# EAGLE design igvc-neopixel (EAGLE 9.5.2)
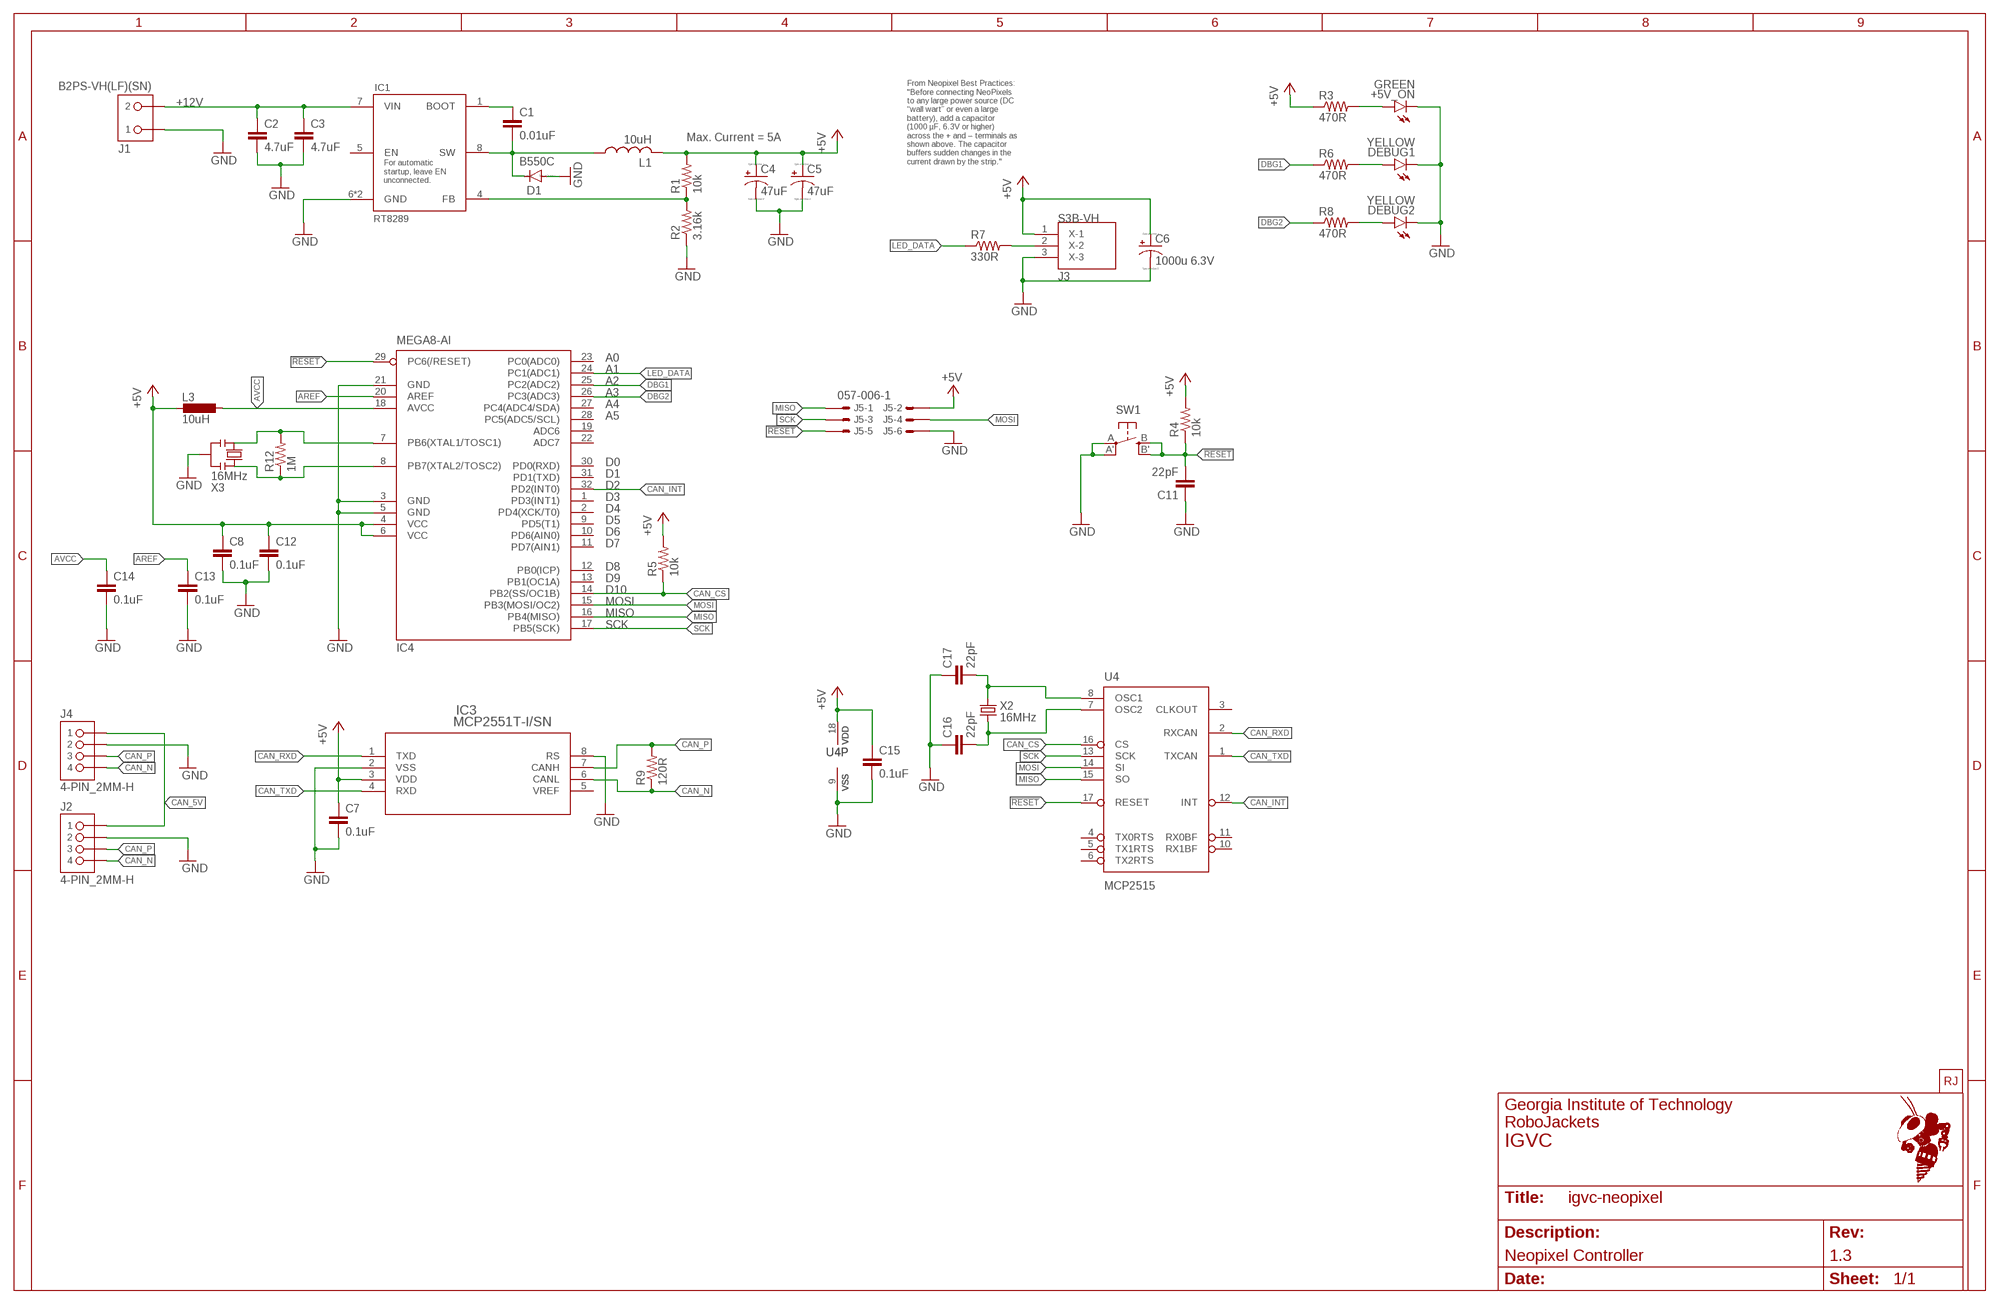
[diagram p0: schematic, sheet 1]
FRAME2 (FRAME_B_L): REVISION: 1.3; SCH_DESC: Neopixel Controller; TEAM: IGVC

## Parts
+5V_ON  GREEN  LEDCHIP-LED0805  [CHIP-LED0805]
C1  0.01uF  C-EUC0603  [C0603]
C2  4.7uF  C-EUC1206  [C1206]
C3  4.7uF  C-EUC1206  [C1206]
C4  47uF  CPOL-USE5-10.5  [E5-10,5]
C5  47uF  CPOL-USE5-10.5  [E5-10,5]
C6  1000u 6.3V  CPOL-USE5-10.5  [E5-10,5]
C7  0.1uF  C-EUC0603  [C0603]
C8  0.1uF  C-EUC0603  [C0603]
C11  22pF  C-EUC0603  [C0603]
C12  0.1uF  C-EUC0603  [C0603]
C13  0.1uF  C-EUC0603  [C0603]
C14  0.1uF  C-EUC0603  [C0603]
C15  0.1uF  C-EUC0603  [C0603]
C16  22pF  C-EUC0603  [C0603]
C17  22pF  C-EUC0603  [C0603]
D1  B550C  DIODE-SMC  [SMC]
DEBUG1  YELLOW  LEDCHIP-LED0805  [CHIP-LED0805]
DEBUG2  YELLOW  LEDCHIP-LED0805  [CHIP-LED0805]
IC1  RT8289  [SOIC8_EP]
IC3  MCP2551T-I/SN  [SOIC8-N_MC]
IC4  MEGA8-AI  [TQFP32-08]
J1  B2PS-VH(LF)(SN)  [B2PS-CENTERED]
J2  4-PIN_2MM-H  [2MM-4-H]
J3  S3B-VH  [S3B-VH]
J4  4-PIN_2MM-H  [2MM-4-H]
J5  057-006-1  [057-006-1]
L1  10uH  SRR1208  [SRR1208]
L3  10uH  L-0805  [0805]
R1  10k  R-US_R0603  [R0603]
R2  3.16k  R-US_R0603  [R0603]
R3  470R  R-US_R0603  [R0603]
R4  10k  R-US_R0603  [R0603]
R5  10k  R-US_R0603  [R0603]
R6  470R  R-US_R0603  [R0603]
R7  330R  R-US_R0603  [R0603]
R8  470R  R-US_R0603  [R0603]
R9  120R  R-US_R0603  [R0603]
R12  1M  R-US_R0603  [R0603]
SW1  SPST_TACT-EVQQ2  [EVQ-Q2]
U4  MCP2515  MCP2510SO  [SO-18W]
U$1  ROBOBUZZ0.6X  [ROBOBUZZ_0.6X]
X2  16MHz  CRYSTAL5X3  [CRYSTAL-SMD-5X3]
X3  16MHz  OSC_CSTCE16M0V53-R0  [RESONATOR]

## Nets
!RESET: C11.2 IC4.29(PC6(/RESET)) J5.5 R4.1 SW1.B'(S1) SW1.B(S) U4.17(RESET)
+5V [power]: C4.+ C5.+ C6.+ C7.1 C8.1 C12.1 C15.1 IC3.3(VDD) IC4.4(VCC) IC4.6(VCC) J3.1(X-1) J5.2 L1.2 L3.2 R1.2 R3.1 R4.2 R5.2 U4.18(VDD)
+12V [power]: C2.1 C3.1 IC1.7(VIN) J1.2
AREF: C13.1 IC4.20(AREF)
AVCC: C14.1 IC4.18(AVCC) L3.1
BOOT: C1.1 IC1.1(BOOT)
CAN_5V [power]: J2.1 J4.1
CAN_CS: IC4.14(PB2(SS/OC1B)) R5.1 U4.16(CS)
CAN_INT: IC4.32(PD2(INT0)) U4.12(INT)
CAN_N: IC3.6(CANL) J2.4 J4.4 R9.1
CAN_P: IC3.7(CANH) J2.3 J4.3 R9.2
CAN_RXD: IC3.1(TXD) U4.2(RXCAN)
CAN_TXD: IC3.4(RXD) U4.1(TXCAN)
DBG1 [power]: IC4.25(PC2(ADC2)) R6.1
DBG2 [power]: IC4.26(PC3(ADC3)) R8.1
FB: IC1.4(FB) R1.1 R2.2
GND [power]: +5V_ON.C C2.2 C3.2 C4.- C5.- C6.- C7.2 C8.2 C11.1 C12.2 C13.2 C14.2 C15.2 C16.1 C17.1 D1.A DEBUG1.C DEBUG2.C IC1.6(GND) IC1.EXP(GND) IC3.2(VSS) IC3.8(RS) IC4.3(GND) IC4.5(GND) IC4.21(GND) J1.1 J2.2 J3.3(X-3) J4.2 J5.6 R2.1 SW1.A'(P1) SW1.A(P) U4.9(VSS) X3.2
LED_DATA: IC4.24(PC1(ADC1)) R7.1
MISO: IC4.16(PB4(MISO)) J5.1 U4.15(SO)
MOSI: IC4.15(PB3(MOSI/OC2)) J5.4 U4.14(SI)
N$17: C17.2 U4.8(OSC1) X2.3
N$18: C16.2 U4.7(OSC2) X2.1
NEOPIXEL: J3.2(X-2) R7.2
PWR_LED: +5V_ON.A R3.2
SCK: IC4.17(PB5(SCK)) J5.3 U4.13(SCK)
STAT1_LED: DEBUG1.A R6.2
STAT2_LED: DEBUG2.A R8.2
SW [power]: C1.2 D1.C IC1.8(SW) L1.1
XTAL1: IC4.7(PB6(XTAL1/TOSC1)) R12.2 X3.1
XTAL2: IC4.8(PB7(XTAL2/TOSC2)) R12.1 X3.3
Unconnected: IC1.5(EN) IC3.5(VREF) IC4.1(PD3(INT1)) IC4.2(PD4(XCK/T0)) IC4.9(PD5(T1)) IC4.10(PD6(AIN0)) IC4.11(PD7(AIN1)) IC4.12(PB0(ICP)) IC4.13(PB1(OC1A)) IC4.19(ADC6) IC4.22(ADC7) IC4.23(PC0(ADC0)) IC4.27(PC4(ADC4/SDA)) IC4.28(PC5(ADC5/SCL)) IC4.30(PD0(RXD)) IC4.31(PD1(TXD)) U4.3(CLKOUT) U4.4(TX0RTS) U4.5(TX1RTS) U4.6(TX2RTS) U4.10(RX1BF) U4.11(RX0BF)

## Notes on the sheet
- Max. Current = 5A
- From Neopixel Best Practices:
  "Before connecting NeoPixels
  to any large power source (DC
  “wall wart” or even a large
  battery), add a capacitor
  (1000 µF, 6.3V or higher)
  across the + and – terminals as
  shown above. The capacitor
  buffers sudden changes in the
  current drawn by the strip."
- For automatic
  startup, leave EN
  unconnected.
- A0
- A1
- A2
- A3
- A4
- A5
- D0
- D1
- D2
- D3
- D4
- D5
- D6
- D7
- D8
- D9
- D10

## Library data of the parts
+5V_ON = led:LED: LED OSRAM: - CHIPLED LG R971, LG N971, LY N971, LG Q971, LY Q971, LO R971, LY R971 LH N974, LH R974 LS Q976, LO Q976, LY Q976 LO Q996 - Hyper CHIPLED LW Q18S LB Q993, LB Q99A, LB R99A - SideLED LS A670, LO A670, LY A670, LG A670, LP A670 LB A673, LV A673, LT A673, LW A673 LH A674 LY A675 LS A676, LA A676, LO A676, LY A676, LW A676 LS A679, LY A679, LG A679 - Hyper Micro SIDELED® LS Y876, LA Y876, LO Y876, LY Y876 LT Y87S - SmartLED LW L88C, LW L88S LB L89C, LB L89S, LG L890 LS L89K, LO L89K, LY L89K LS L896, LA L896, LO L896, LY L896 - TOPLED LS T670, LO T670, LY T670, LG T670, LP T670 LSG T670, LSP T670, LSY T670, LOP T670, LYG T670 LG T671, LOG T671, LSG T671 LB T673, LV T673, LT T673, LW T673 LH T674 LS T676, LA T676, LO T676, LY T676, LB T676, LH T676, LSB T676, LW T676 LB T67C, LV T67C, LT T67C, LS T67K, LO T67K, LY T67K, LW E67C LS E67B, LA E67B, LO E67B, LY E67B, LB E67C, LV E67C, LT E67C LW T67C LS T679, LY T679, LG T679 LS T770, LO T770, LY T770, LG T770, LP T770 LB T773, LV T773, LT T773, LW T773 LH T774 LS E675, LA E675, LY E675, LS T675 LS T776, LA T776, LO T776, LY T776, LB T776 LHGB T686 LT T68C, LB T68C - Hyper Mini TOPLED® LB M676 - Mini TOPLED Santana® LG M470 LS M47K, LO M47K, LY M47K Source: http://www.osram.convergy.de LUXEON: - LUMILED® LXK2-PW12-R00, LXK2-PW12-S00, LXK2-PW14-U00, LXK2-PW14-V00 LXK2-PM12-R00, LXK2-PM12-S00, LXK2-PM14-U00 LXK2-PE12-Q00, LXK2-PE12-R00, LXK2-PE12-S00, LXK2-PE14-T00, LXK2-PE14-U00 LXK2-PB12-K00, LXK2-PB12-L00, LXK2-PB12-M00, LXK2-PB14-N00, LXK2-PB14-P00, LXK2-PB14-Q00 LXK2-PR12-L00, LXK2-PR12-M00, LXK2-PR14-Q00, LXK2-PR14-R00 LXK2-PD12-Q00, LXK2-PD12-R00, LXK2-PD12-S00 LXK2-PH12-R00, LXK2-PH12-S00 LXK2-PL12-P00, LXK2-PL12-Q00, LXK2-PL12-R00 Source: www.luxeon.com KINGBRIGHT: KA-3528ASYC Source: www.kingbright.com; DIGIKEY: 732-4982-1-ND
C1 = resistor:C-EU: CAPACITOR, European symbol; DIGIKEY: 311-1572-1-ND
C2 C3 = resistor:C-EU: CAPACITOR, European symbol; DIGIKEY: 1276-3178-1-ND
C4 C5 = resistor:CPOL-US: POLARIZED CAPACITOR, American symbol; DIGIKEY: PCE3753CT-ND
C6 = resistor:CPOL-US: POLARIZED CAPACITOR, American symbol; DIGIKEY: 493-2160-1-ND
C7 = rcl:C-EU: CAPACITOR, European symbol; DIGIKEY: 399-1099-1-ND; SPICEPREFIX: C
C8 C12-C14 C16 C17 = resistor:C-EU: CAPACITOR, European symbol; DIGIKEY: 399-1099-1-ND
C11 = resistor:C-EU: CAPACITOR, European symbol; DIGIKEY: 311-3952-1-ND
C15 = rcl:C-EU: CAPACITOR, European symbol; SPICEPREFIX: C
D1 = diode:DIODE-: DIODE; DIGIKEY: B550C-FDICT-ND
DEBUG1 DEBUG2 = led:LED: LED OSRAM: - CHIPLED LG R971, LG N971, LY N971, LG Q971, LY Q971, LO R971, LY R971 LH N974, LH R974 LS Q976, LO Q976, LY Q976 LO Q996 - Hyper CHIPLED LW Q18S LB Q993, LB Q99A, LB R99A - SideLED LS A670, LO A670, LY A670, LG A670, LP A670 LB A673, LV A673, LT A673, LW A673 LH A674 LY A675 LS A676, LA A676, LO A676, LY A676, LW A676 LS A679, LY A679, LG A679 - Hyper Micro SIDELED® LS Y876, LA Y876, LO Y876, LY Y876 LT Y87S - SmartLED LW L88C, LW L88S LB L89C, LB L89S, LG L890 LS L89K, LO L89K, LY L89K LS L896, LA L896, LO L896, LY L896 - TOPLED LS T670, LO T670, LY T670, LG T670, LP T670 LSG T670, LSP T670, LSY T670, LOP T670, LYG T670 LG T671, LOG T671, LSG T671 LB T673, LV T673, LT T673, LW T673 LH T674 LS T676, LA T676, LO T676, LY T676, LB T676, LH T676, LSB T676, LW T676 LB T67C, LV T67C, LT T67C, LS T67K, LO T67K, LY T67K, LW E67C LS E67B, LA E67B, LO E67B, LY E67B, LB E67C, LV E67C, LT E67C LW T67C LS T679, LY T679, LG T679 LS T770, LO T770, LY T770, LG T770, LP T770 LB T773, LV T773, LT T773, LW T773 LH T774 LS E675, LA E675, LY E675, LS T675 LS T776, LA T776, LO T776, LY T776, LB T776 LHGB T686 LT T68C, LB T68C - Hyper Mini TOPLED® LB M676 - Mini TOPLED Santana® LG M470 LS M47K, LO M47K, LY M47K Source: http://www.osram.convergy.de LUXEON: - LUMILED® LXK2-PW12-R00, LXK2-PW12-S00, LXK2-PW14-U00, LXK2-PW14-V00 LXK2-PM12-R00, LXK2-PM12-S00, LXK2-PM14-U00 LXK2-PE12-Q00, LXK2-PE12-R00, LXK2-PE12-S00, LXK2-PE14-T00, LXK2-PE14-U00 LXK2-PB12-K00, LXK2-PB12-L00, LXK2-PB12-M00, LXK2-PB14-N00, LXK2-PB14-P00, LXK2-PB14-Q00 LXK2-PR12-L00, LXK2-PR12-M00, LXK2-PR14-Q00, LXK2-PR14-R00 LXK2-PD12-Q00, LXK2-PD12-R00, LXK2-PD12-S00 LXK2-PH12-R00, LXK2-PH12-S00 LXK2-PL12-P00, LXK2-PL12-Q00, LXK2-PL12-R00 Source: www.luxeon.com KINGBRIGHT: KA-3528ASYC Source: www.kingbright.com; DIGIKEY: 732-4987-1-ND
IC1 = misc:RT8289; DIGIKEY: 1028-1046-1-ND
IC3 = MCP2551T:MCP2551T-I/SN; DIGIKEY: MCP2551T-I/SNCT-ND; MANUFACTURER_PART_NUMBER: MCP2551TISN; VENDOR: Microchip
IC4 = atmel:MEGA8: MICROCONTROLLER 8 Kbytes FLASH, 1 kbytes SRAM, 512 bytes EEPROM, USART, 6-channel 10 bit ADC, 2-channel 8 bit ADC Pin compatible with Atmega48, ATMega88, ATMega168 Source: avr.lbr; DIGIKEY: ATMEGA328P-AURCT-ND; MPN: ATMEGA8-16AU; OC_FARNELL: 9171371; OC_NEWARK: 73M8863
J1 = RoboJackets-Connectors:B2P?-VH(LF)(SN): Power Connector Brand: JST Sales America Inc. <https://www.jst.com/> Series: VH <http://www.digikey.com/product-search/en?FV=fff40016,fff802f3,ffec0e9d> Distributor: Digi-Key <http://www.digikey.com/product-detail/en/B2PS-VH%28LF%29%28SN%29/455-1648-ND/926555>; DIGIKEY: 455-1648-ND; MPN: B2PS-VH(LF)(SN)
J2 J4 = RoboJackets-Connectors:4-PIN_2MM-*: MPN: 0353630460; DIGIKEY: WM18933-ND; MPN: 0353630460
J3 = IGVC-Connector:S3B-VH; DIGIKEY: 455-1649-ND
J5 = con-panduit:057-006-: CONNECTOR 6-pin series 057 contact pc board low profile headers; DIGIKEY: 3M15451-ND; OC_FARNELL: unknown; OC_NEWARK: unknown
L1 = misc:SRR1208; DIGIKEY: SRR1208-100MLCT-ND
L3 = IGVC-Remote:L; DIGIKEY: 490-1053-1-ND
R1 R4 = resistor:R-US_: RESISTOR, American symbol; DIGIKEY: RNCP0603FTD10K0CT-ND
R2 = resistor:R-US_: RESISTOR, American symbol; DIGIKEY: RMCF0603FT3K16CT-ND
R3 R6 R8 = resistor:R-US_: RESISTOR, American symbol; DIGIKEY: RMCF0603JT470RCT-ND
R5 = rcl:R-US_: RESISTOR, American symbol; SPICEPREFIX: R
R7 = rcl:R-US_: RESISTOR, American symbol; DIGIKEY: RMCF0603JT330RCT-ND; SPICEPREFIX: R
R9 = rcl:R-US_: RESISTOR, American symbol; DIGIKEY: RMCF0603JT120RCT-ND; SPICEPREFIX: R
R12 = resistor:R-US_: RESISTOR, American symbol; DIGIKEY: 311-1.00MHRCT-ND
SW1 = adafruit:SPST_TACT: SMT 6mm switch, EVQQ2 series http://www.ladyada.net/library/eagle; DIGIKEY: P12961SCT-ND
U4 = SparkFun-DigitalIC:MCP2510: CAN controller with SPI interface to any MCU. Original design by Microchip.; PROD_ID: IC-09906
U$1 = RoboJackets-Aesthetics:ROBOBUZZ
X2 = SparkFun-FreqCtrl:CRYSTAL: Various standard crystals. Proven footprints.; PROD_ID: XTAL-08218
X3 = IGVC-Remote:OSC_CSTCE16M0V53-R0: 16Mhz - SMD; DIGIKEY: 490-17948-1-ND; MONTHLY_USAGE: _____; PART_NUMBER: CSTCE16M0V53-R0; PRICE: _____; SUPPLIER: _____; TYPE: Cristalli; VALUE: CSTCE16M0V53-R0

## Net classes
1 power: width 0.3 mm

## Board
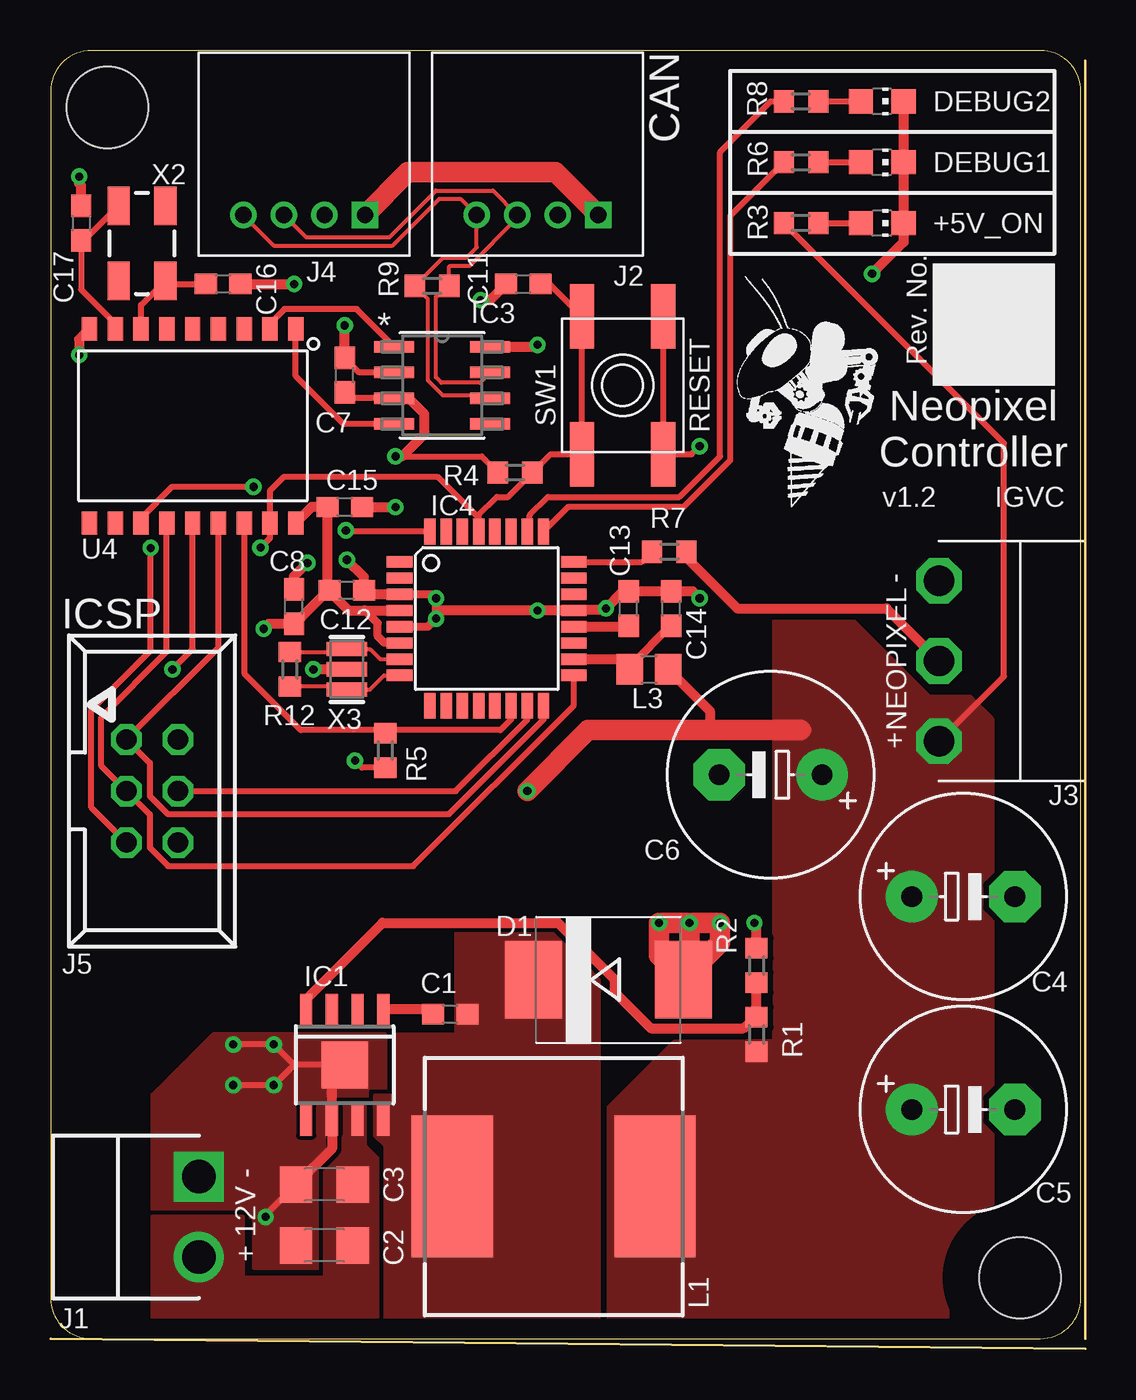
[diagram p1: board, top side]
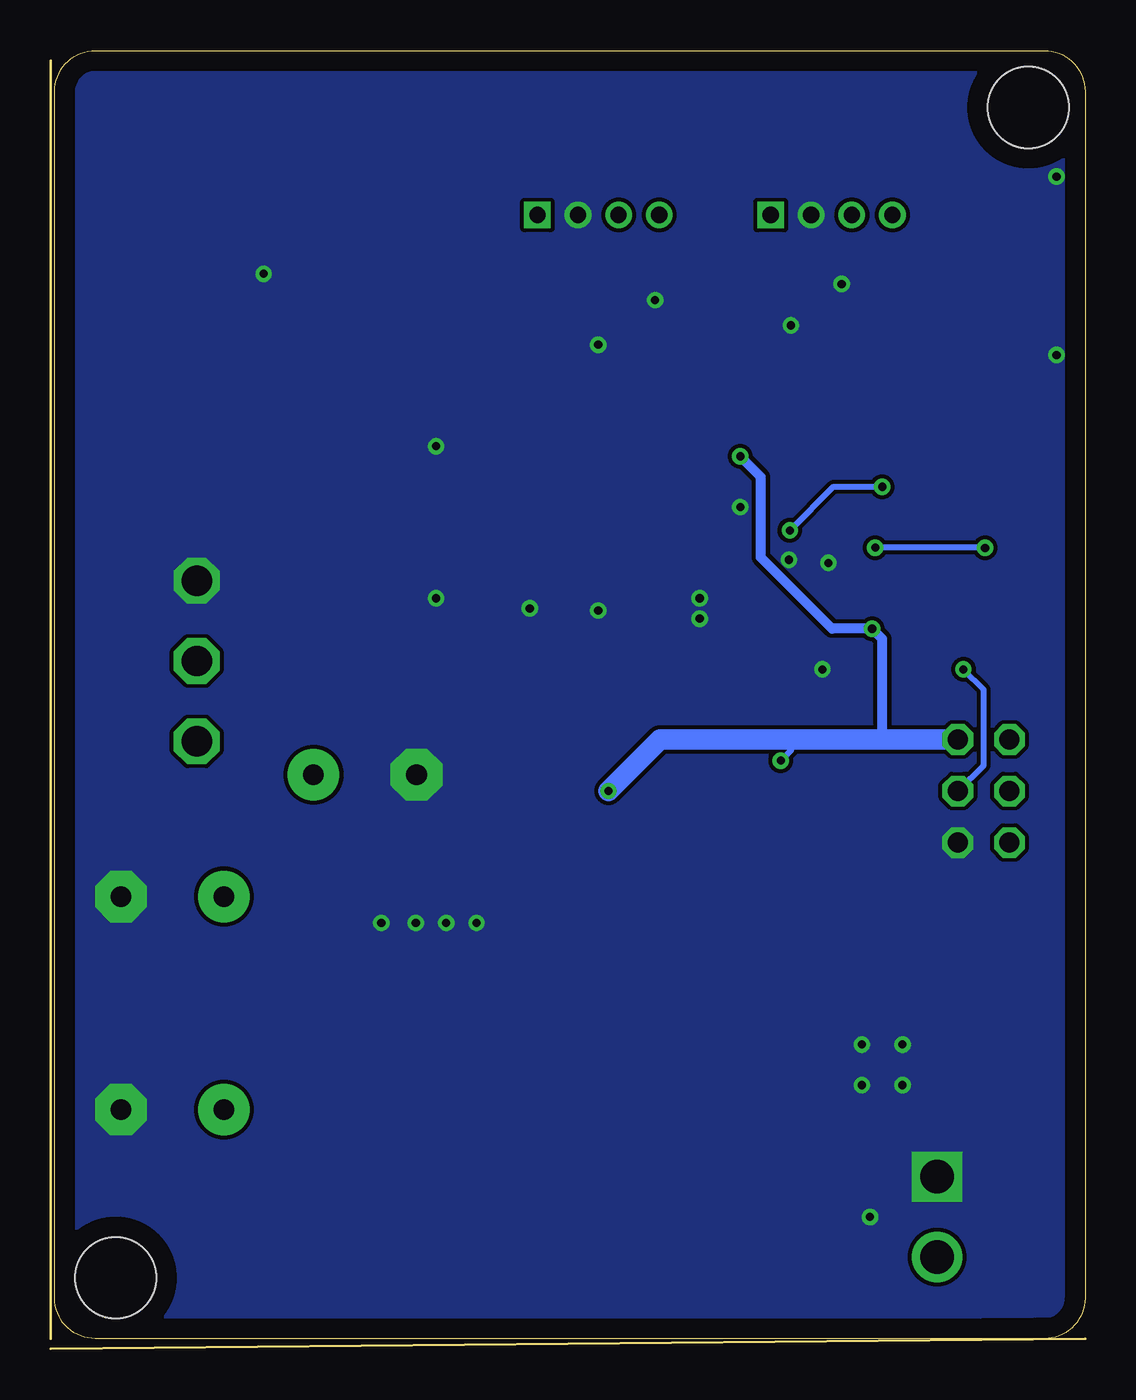
[diagram p2: board, bottom side, seen from below]

Size 50.8 x 63.5 mm. Coordinates in mm from the lower left corner, seen from the top.
Outline: 0,61.5 0,2 arc90 2,0 48.8,0 arc90 50.8,2 50.8,61.5 arc90 48.8,63.5 2,63.5 arc90 0,61.5
Copper layers (1*16): Top 0.0356mm / dielectric 63mil / Bottom 0.0356mm
Design rules "RJ2LayerDRU *": minimum track width 0.2mm, minimum drill 0.4mm, track to track 0.2mm, track to pad 0.25mm, pad to pad 0.2mm, via to via 0.25mm, smd to smd 0.2mm, copper to edge 1mm, drill to drill 0.2mm, minimum pad ring 10mil, minimum via ring 8mil, stop-mask expansion 4mil, vias tented up to drill 16mil, thermal gap 10mil
Holes 4 mm at 47.8,3 2.8,60.7
tKeepout: area -0.7,57.2 to 6.3,64.2
tRestrict: area 44.3,-0.5 to 51.3,6.5

### Footprints (pad centres in the part's own frame; a part is rotated, then mirrored left to right if it is on the bottom)
CHIP-LED0805 = smd 1.2 x 1.2: A 0,-1.05; C 0,1.05
C0603 = smd 1.1 x 1: 1 -0.85,0; 2 0.85,0
C1206 = smd 1.6 x 1.8: 1 -1.4,0; 2 1.4,0
E5-10,5 = drill 1.016 pad 2.54: + -2.54,0 | drill 1.016 pad 2.54 octagon: - 2.54,0
SMC = smd 2.8 x 3.8: A 3.7,0; C -3.7,0
SOIC8_EP = smd 0.6 x 1.5: 1 -1.905,-2.75; 2 -0.635,-2.75; 3 0.635,-2.75; 4 1.905,-2.75; 5 1.905,2.75; 6 0.635,2.75; 7 -0.635,2.75; 8 -1.905,2.75 | smd 2.3 x 2.3: EXP 0,0
SOIC8-N_MC = smd 1.981 x 0.559: 1 -2.362,1.905; 2 -2.362,0.635; 3 -2.362,-0.635; 4 -2.362,-1.905; 5 2.362,-1.905; 6 2.362,-0.635; 7 2.362,0.635; 8 2.362,1.905
TQFP32-08 = smd 1.27 x 0.559: 1 -4.293,2.8; 2 -4.293,2; 3 -4.293,1.2; 4 -4.293,0.4; 5 -4.293,-0.4; 6 -4.293,-1.2; 7 -4.293,-2; 8 -4.293,-2.8; 17 4.293,-2.8; 18 4.293,-2; 19 4.293,-1.2; 20 4.293,-0.4; 21 4.293,0.4; 22 4.293,1.2; 23 4.293,2; 24 4.293,2.8 | smd 0.559 x 1.27: 9 -2.8,-4.293; 10 -2,-4.293; 11 -1.2,-4.293; 12 -0.4,-4.293; 13 0.4,-4.293; 14 1.2,-4.293; 15 2,-4.293; 16 2.8,-4.293; 25 2.8,4.293; 26 2,4.293; 27 1.2,4.293; 28 0.4,4.293; 29 -0.4,4.293; 30 -1.2,4.293; 31 -2,4.293; 32 -2.8,4.293
B2PS-CENTERED = drill 1.65 square: 1 -1.98,0 | drill 1.65: 2 1.98,0
2MM-4-H = drill 0.8 square: 1 -3,0 | drill 0.8: 2 -1,0; 3 1,0; 4 3,0
S3B-VH = drill 1.5 octagon: 1 1.95,7.2; 2 5.91,7.2; 3 9.87,7.2
057-006-1 = drill 1 octagon: 1 -2.54,-1.27; 2 -2.54,1.27; 3 0,-1.27; 4 0,1.27; 5 2.54,-1.27; 6 2.54,1.27
SRR1208 = smd 4 x 7: 1 -5,0; 2 5,0
0805 = smd 1.3 x 1.5: 1 -0.95,0; 2 0.95,0
R0603 = smd 1 x 1.1: 1 -0.85,0; 2 0.85,0
EVQ-Q2 = smd 3.2 x 1.2: A -3.4,-2; A' 3.4,-2; B -3.4,2; B' 3.4,2
SO-18W = smd 0.762 x 1.143: 1 -5.08,-4.788; 2 -3.81,-4.788; 3 -2.54,-4.788; 4 -1.27,-4.788; 5 0,-4.788; 6 1.27,-4.788; 7 2.54,-4.788; 8 3.81,-4.788; 9 5.08,-4.788; 10 5.08,4.788; 11 3.81,4.788; 12 2.54,4.788; 13 1.27,4.788; 14 0,4.788; 15 -1.27,4.788; 16 -2.54,4.788; 17 -3.81,4.788; 18 -5.08,4.788
CRYSTAL-SMD-5X3 = smd 1.9 x 1.1: 1 -1.85,-1.15; 2 1.85,-1.15; 3 1.85,1.15; 4 -1.85,1.15
RESONATOR = smd 0.7 x 2: 1 -1,0; 2 0,0; 3 1,0

### Placement (x,y rotation side)
+5V_ON  41,55 270 top
C1  19.7,16 0 top
C2  13.5,4.6 180 top
C3  13.5,7.6 180 top
C4  45,21.8 0 top
C5  45,11.3 0 top
C6  35.5,27.8 180 top
C7  14.5,47.5 90 top
C8  12,36.1 90 top
C11  23.3,52 0 top
C12  14.6,36.9 0 top
C13  28.5,36 90 top
C14  30.6,36 90 top
C15  14.5,41 0 top
C16  8.5,52 180 top
C17  1.5,55 270 top
D1  27.5,17.7 0 top
DEBUG1  41,58 270 top
DEBUG2  41,61 270 top
IC1  14.5,13.5 180 top
IC3  19.3,47 0 top
IC4  21.5,35.5 0 top
J1  7.3,6 270 top
J2  24,55.4 180 top
J3  51,27.5 90 top
J4  12.5,55.4 180 top
J5  5,27 270 top
L1  24.8,7.5 0 top
L3  29.5,33 0 top
R1  34.8,15 270 top
R2  34.8,18.4 270 top
R3  37,55 0 top
R4  22.9,42.7 180 top
R5  16.5,29 270 top
R6  37,58 0 top
R7  30.5,38.8 0 top
R8  37,61 0 top
R9  18.8,51.9 0 top
R12  11.8,33 90 top
SW1  28.2,47 90 top
U4  7,45 180 top
U$1  36.5,41 0 top
X2  4.5,54 90 top
X3  14.6,33 270 top

### Tracks (layer width: path | path; a pad name or v marks a point on that pad's centre or on a via)
!RESET  (via drill 0.4)
  Top 0.3: J5.5 2,26.19 2,31 4.93,33.93 v4.93,38.99 | v10.34,39 10.81,39.47 U4.17 10.81,41.81 11.5,42.5 19.07,42.5 21.1,40.47 IC4.29 21.1,40.6 22,41.5 22.55,41.5 R4.1 24.65,43.6 SW1.B SW1.B' 24.6,52 C11.2
  Bottom 0.3: v4.93,38.99 v4.94,39 v10.34,39
+5V  (via drill 0.4)
  Top 0.3: IC3.3 14.79,46.37 C7.1 | R5.2 15.35,28.15 v15,28.5 | v17,43.5 21.25,43.5 R4.2 | J3.1 47,32.65 47,44.15 R3.1
  Top 0.4: 15.5,35.9 16.12,35.28 16.12,34.63 16.46,34.3 IC4.6
  Top 0.5: C12.1 13.71,36.9 12.06,35.25 C8.1 10.75,35.25 v10.5,35 | IC4.4 15.5,35.9 14.69,35.9 13.75,36.84 C12.1 | U4.18 12.87,41 C15.1 13.65,37 C12.1 | IC3.3 17.64,46.37 18.43,45.58 18.43,44.61 17.32,43.5 v17,43.5 | L3.2 32.5,30.95 32.5,30
  Top 1: v23.5,27 26.5,30 32.5,30 37,30
  Bottom 0.3: v15,28.5 14.5,29 14.5,29.54
  Bottom 0.5: 10,29.54 10,34.5 v10.5,35 12.48,35 15.99,38.51 15.99,42.49 v17,43.5
  Bottom 1: J5.2 10,29.54 14.5,29.54 20.96,29.54 v23.5,27
  pour Top (isolate 0.3, rank 4, no thermals): 27.3,1 46.3,1 46.3,30.5 45.3,31.5 43.3,31.5 38.8,36 35.8,36 35.8,14.5 30.8,14.5 27.3,11
+12V
  pour Top (rank 2, no thermals): 5,6 5,0 16.5,0 16.5,8.5 15.5,9.5 15.5,11.5 14.5,11.5 14.5,10 13.5,9 13.5,3 9.5,3 9.5,6
AREF
  Top 0.5: IC4.20 28.45,35.1 C13.1
AVCC
  Top 0.4: L3.1 28.55,33.14 30.56,35.15 C14.1
  Top 0.5: IC4.18 28.05,33.5 L3.1
BOOT
  Top 0.5: IC1.1 18.5,16.25 C1.1
CAN_5V
  Top 1: J4.1 17.6,57.5 24.9,57.5 J2.1
CAN_CS
  Top 0.3: U4.16 9.54,32.79 12.33,30 16.65,30 | IC4.14 22.7,30.53 22.17,30 17,30 16.65,30 | R5.1 16.65,30
CAN_INT  (via drill 0.4)
  Top 0.3: IC4.32 14.61,39.79 v14.55,39.85 | v10,42 6,42 4.46,40.46 U4.12
  Bottom 0.3: v14.55,39.85 12.4,42 v10,42
CAN_N
  Top 0.2: J4.4 11,53.9 16.87,53.9 19.17,56.2 20.2,56.2 J2.4 21,53.8 20.5,53.3 19.35,53.3 R9.1 18.6,51.25 18.6,47.24 19.33,46.51 21.51,46.51 IC3.6
CAN_P
  Top 0.2: J4.3 12.6,54.3 16.7,54.3 19,56.6 21.8,56.6 J2.3 23,55.23 20.67,52.9 19.7,52.9 19.65,52.85 19.65,52 | IC3.7 21.16,47.13 19.27,47.13 19,47.41 19,51.35 19.65,52 | R9.2 19.65,52
CAN_RXD
  Top 0.3: U4.2 10.81,50.04 11.53,50.76 15.08,50.76 IC3.1
CAN_TXD
  Top 0.3: IC3.4 14.44,45.09 12.08,47.45 U4.1
DBG1
  Top 0.3: R6.1 33.5,55.35 33.5,43.29 31.21,41 25.51,41 IC4.25
DBG2
  Top 0.3: R8.1 35.5,61 33,58.5 33,43.5 31,41.5 24.53,41.5 23.62,40.59 23.62,39.91 IC4.26
FB
  Top 0.5: IC1.4 12.6,16.74 16.36,20.5 25.01,20.5 27.8,17.71 27.8,17.09 29.59,15.3 34.15,15.3 R1.1 R2.2
GND  (via drill 0.4)
  Top 0.3: IC1.EXP 12,13.5 | 12,13.5 v11,14.5 v9,14.5 | 12,13.5 v11,12.5 v9,12.5 | C3.2 10.6,6.1 v10.6,6 | IC3.2 15.21,47.63 C7.2 | SW1.A' SW1.A 31.6,43.6 v32,44
  Top 0.4: IC4.3 18.8,36.7 v19,36.5 v19,35.5 18.6,35.1 IC4.5
  Top 0.5: IC4.3 15.65,36.7 C12.2 15.45,37.55 v14.6,38.4 | v32,36.5 31.65,36.85 C14.2 C13.2 28.23,36.85 v27.38,36 27.3,35.92 25.81,35.92 IC4.21 v24,35.9 19.3,35.9 19,35.6 v19,35.5 | X3.2 v12.95,33 | C8.2 12,37.59 v12.65,38.25 | C3.2 13.87,9.37 IC1.6 13.87,12.87 IC1.EXP | R2.1 34.8,20.4 v34.7,20.5 | IC3.8 23.91,48.91 v24,49 | C15.2 v17,41 | U4.9 1.4,49.27 v1.4,48.5 | DEBUG2.C DEBUG1.C +5V_ON.C 42.05,54.05 v40.5,52.5 | C17.1 1.5,56.85 1.4,56.95 v1.4,57.3 | C16.1 v12,52 | C7.2 v14.5,49.96 | C11.1 21.65,51.2 v21.2,51.2
  Top 1: v31.5,20.5 v30,20.5 30,18.9 D1.A | v31.5,20.5 v33,20.5 33,19.5 D1.A | v31.5,20.5 31.5,18 D1.A
  pour Bottom (rank 6, no thermals): -1,-1 51.8,-1 51.8,64.5 -1,64.5
  pour Top (rank 3, no thermals): 5,12 5,6 10,6 10,3.5 13.5,3.5 13.5,12 16.5,12 16.5,15 8,15
LED_DATA
  Top 0.3: IC4.24 29.15,38.3 R7.1
MISO
  Top 0.3: IC4.16 24.3,30.53 19.62,25.85 5.79,25.85 4.88,26.75 4.88,28.39 J5.1 8.27,34.08 U4.15
MOSI  (via drill 0.4)
  Top 0.3: J5.4 19.97,27 23.5,30.53 IC4.15 | v6,33 7,34 U4.14
  Bottom 0.3: J5.4 5,28.27 5,32 v6,33
N$17
  Top 0.3: U4.8 3.19,50.04 1.5,51.73 C17.2 1.65,54.15 X2.3
N$18
  Top 0.3: U4.7 4.46,50.96 X2.1 5.8,52 C16.2
NEOPIXEL
  Top 0.5: J3.2 41.21,36 33.85,36 31.35,38.5 R7.2
PWR_LED
  Top 0.3: R3.2 +5V_ON.A
SCK
  Top 0.3: IC4.17 25.79,31.22 17.88,23.31 5.79,23.31 4.88,24.21 4.88,25.85 J5.3 2.5,28.23 2.5,30.64 5.73,33.87 U4.13
STAT1_LED
  Top 0.3: R6.2 DEBUG1.A
STAT2_LED
  Top 0.3: R8.2 DEBUG2.A
SW
  pour Top (no thermals): 16,12 17,12 17,15 20,15 20,20.5 25,20.5 27,18.5 27,10.5 27,0 16.5,0 16.5,9.5 16,10
XTAL1
  Top 0.2: R12.2 14.45,33.85 X3.1 15.74,34 16.25,33.5 IC4.7
XTAL2
  Top 0.2: R12.1 14.45,32.15 X3.3 15.74,32 16.45,32.7 IC4.8

### Text on the board
tPlace: Rev. No. | Neopixel / Controller | v1.2 | IGVC | ICSP
tNames: CAN | RESET | - | NEOPIXEL | + | + 12V -